# Altium schematic sheet Discharge.SchDoc
size A4
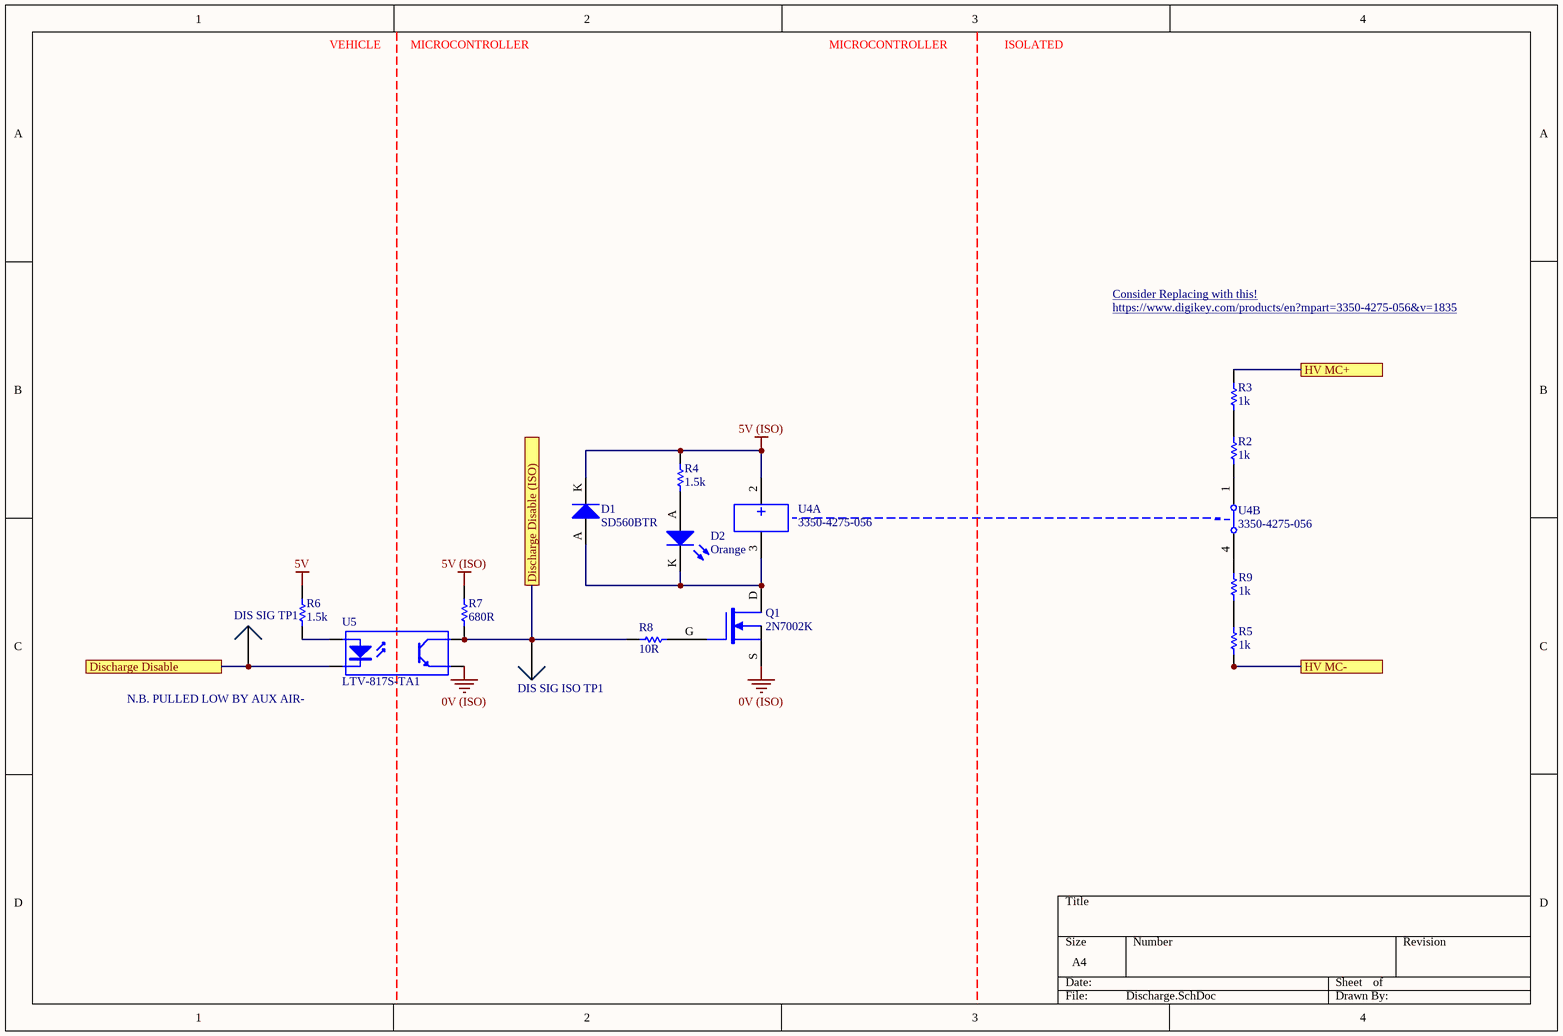
[diagram p0: Discharge.SchDoc]

## Parts
D1  SD560BTR  [SMB Diode]
D2  Orange  [0805 LED]
DIS_SIG_ISO_TP1  0mm  [SMD Test Point]  (value not drawn)
DIS_SIG_TP1  0mm  [SMD Test Point]  (value not drawn)
Q1  2N7002K  [ON SOT-23 MOSFET]
R2  1k  [B TO-263]
R3  1k  [B TO-263]
R4  1.5k  [0805]
R5  1k  [B TO-263]
R6  1.5k  [0805]
R7  680R  [0805]
R8  10R  [0805]
R9  1k  [B TO-263]
U4  3350-4275-056  [CI SPST]  (parts A,B of 2)
U5  LTV-817S-TA1  [ON 4-SMD]

## Ports
Discharge Disable, Discharge Disable (ISO), HV MC+, HV MC-

## Nets
0V (ISO): Q1.S U5.3(E)
5V: R6.2
5V (ISO): D1.K R4.2 R7.2 U4.2
Discharge Disable: DIS_SIG_TP1.1 U5.2(K) ; port Discharge Disable
Discharge Disable (ISO): DIS_SIG_ISO_TP1.1 R7.1 R8.1 U5.4(C) ; port Discharge Disable (ISO)
HV MC+: R3.1 ; port HV MC+
HV MC-: R5.2 ; port HV MC-
NetD1_A: D1.A D2.K Q1.D U4.3
NetD2_A: D2.A R4.1
NetQ1_G: Q1.G R8.2
NetR2_1: R2.1 R3.2
NetR2_2: R2.2 U4.1
NetR5_1: R5.1 R9.2
NetR6_1: R6.1 U5.1(A)
NetR9_1: R9.1 U4.4

## Notes on the sheet
- VEHICLE
- MICROCONTROLLER
- ISOLATED
- https://www.digikey.com/products/en?mpart=3350-4275-056&v=1835
- Consider Replacing with this! <https://www.digikey.com/products/en?mpart=3350-4275-056&v=1835>
- N.B. PULLED LOW BY AUX AIR-

## Library data of the parts
D1 = SD560BTR: 1.2V_F 600V 5A SMB; Manufacturer: SMC Diode Solutions; Part Number: SD560BTR; Digikey Part Number: 1655-1530-2-ND; Digikey Link: https://www.digikey.com/product-detail/en/smc-diode-solutions/SD560BTR/1655-1530-2-ND/6022620
D2 = SML-211DTT86: Orange LED Indication - Discrete 1.75V 0805 (2012 Metric); Manufacturer: ROHM Semiconductor; Part Number: SML-211DTT86; Colour: Orange; Digikey Part Number: 511-1291-1-ND; Digikey Link: https://www.digikey.com/product-detail/en/rohm-semiconductor/SML-211DTT86/511-1291-1-ND/637104
DIS_SIG_ISO_TP1 DIS_SIG_TP1 = SMD Test Point: Positions: 1; Row Spacing: 0; Flange: No; Contact: NA; Part Number: SMD Test Point; Pitch: 0mm; Angle: 0
Q1 = 2N7002K: 60V 380mA, NFET MOSTFET (Small Signal); Manufacturer: ON Semiconductor; Published: 24-Mar-1999; LatestRevisionDate: 29-May-2009; LatestRevisionNote: IPC-7351 Footprint Added.; PackageVersion: Sep-2000; PackageReference: SOT-343; Publisher: Altium Limited; PackageDescription: 4-Pin SOT-343 Package 1.3 mm Pitch, 2.1 mm Lead Span; Part Number: 2N7002K; Digikey Part Number: 2N7002KCT-ND; Digikey Link: https://www.digikey.com/product-detail/en/on-semiconductor/2N7002K/2N7002KCT-ND/2060375; Qty: 30
R2 R3 R5 R9 = PWR263S-35-1001J: Manufacturer: Bournes Inc; Tolerance: 0.05; Rated Voltage: 35W; Part Number: PWR263S-35-1001J; Value: 1k; Digikey Part Number: PWR263S-35-1001J-ND
R4 R6 = RC0805FR071K5L: Manufacturer: YAGEO; Tolerance: 0.01; Rated Voltage: 0.125W; Part Number: RC0805FR071K5L; Value: 1.5k; Material: FR-07
R7 = RC0805FR07680RL: Manufacturer: YAGEO; Tolerance: 0.01; Rated Voltage: 0.125W; Part Number: RC0805FR07680RL; Value: 680R; Material: FR-07
R8 = RC0805FR0710RL: Manufacturer: YAGEO; Tolerance: 0.01; Rated Voltage: 0.125W; Part Number: RC0805FR0710RL; Value: 10R; Material: FR-07
U4 = 3350-4275-056: RELAY REED HV SPST 200W 3A 5V (NC); Manufacturer: Comus International; Part Number: 3350-4275-056; Digikey Part Number: 1835-1039-ND; Digikey Link: https://www.digikey.com.au/product-detail/en/comus-international/3350-4275-056/1835-1039-ND/7515921
U5 = LTV-817S-TA1: 35V 50ma Optocoupler (VF=1.2V); Manufacturer: Lite-On Inc; Part Number: LTV-817S-TA1; Digikey Part Number: 160-1893-2-ND; Digikey Link: https://www.digikey.com/product-detail/en/lite-on-inc/LTV-817S-TA1/160-1893-2-ND/388451